# Altium schematic sheet MCU.SchDoc
size A3
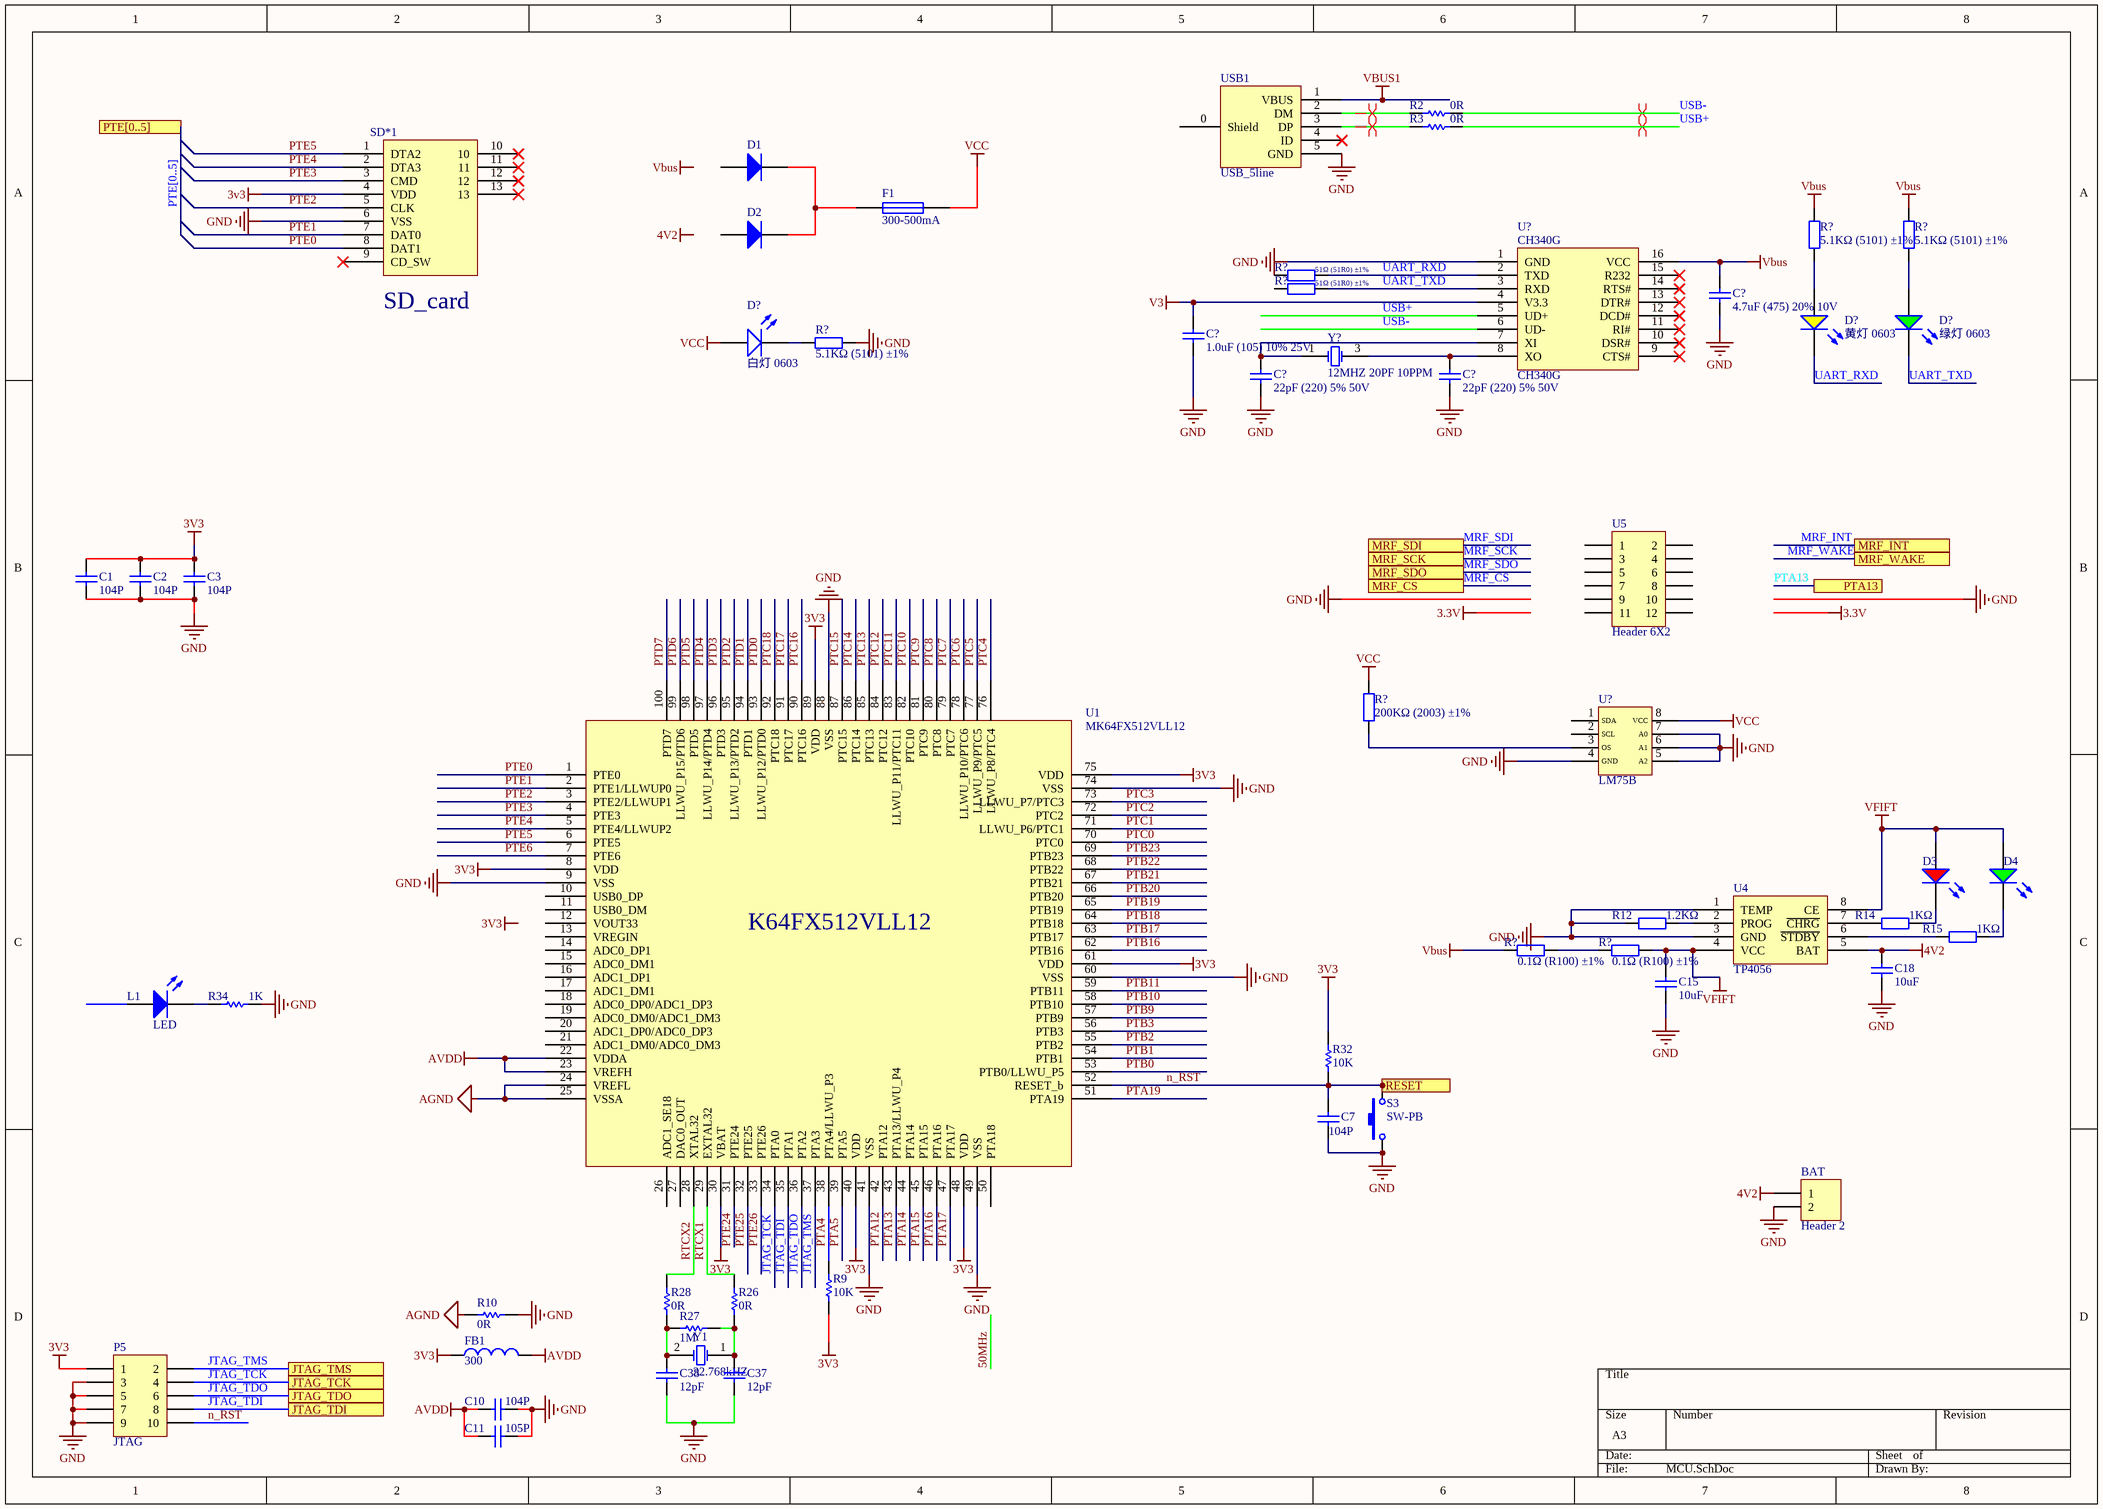
[diagram p0: MCU.SchDoc]

## Parts
(Parts that share a designator on the sheet are numbered #1, #2 ... from top to bottom, then left to right.)
BAT  Header 2  [HDR1X2]
C1  value 104P  [0402]  (hidden comment: Cap)
C2  value 104P  [0402]  (hidden comment: Cap)
C3  value 104P  [0402]  (hidden comment: Cap)
C7  value 104P  [1608[0603]]  (hidden comment: Cap)
C10  value 104P  [0402]  (hidden comment: Cap)
C11  value 105P  [0402]  (hidden comment: Cap)
C15  10uF  [0402_C]
C18  10uF  [0402_C]
C37  value 12pF  [1608[0603]]  (hidden comment: Cap)
C38  value 12pF  [1608[0603]]  (hidden comment: Cap)
C?#1  4.7uF (475) 20% 10V  [0402_C]
C?#2  1.0uF (105) 10% 25V  [0402_C]
C?#3  22pF (220) 5% 50V  [0402_C]
C?#4  22pF (220) 5% 50V  [0402_C]
D1  sk4  [1206(2)]  (value not drawn)
D2  sk4  [1206(2)]  (value not drawn)
D3  红灯 0603  [0603_LED_S1]  (value not drawn)
D4  绿灯 0603  [0603_LED_S1]  (value not drawn)
D?#1  黄灯 0603  [0603_LED_S1]
D?#2  绿灯 0603  [0603_LED_S1]
D?#3  白灯 0603  [0603_LED_S1]
F1  300-500mA  [1206(2)]
FB1  value 300  [0402]  (hidden comment: Inductor)
L1  LED  [1608[0603]]
P5  JTAG  [MHDR2X5]
R2  value 0R  [1608[0603]]  (hidden comment: Res)
R3  value 0R  [1608[0603]]  (hidden comment: Res)
R9  value 10K  [1608[0603]]  (hidden comment: Res)
R10  value 0R  [0402]  (hidden comment: Res)
R12  1.2KΩ  [0402_R]
R14  1KΩ  [0402_R]
R15  1KΩ  [0402_R]
R26  value 0R  [1608[0603]]  (hidden comment: Res)
R27  value 1M  [1608[0603]]  (hidden comment: Res)
R28  value 0R  [1608[0603]]  (hidden comment: Res)
R32  value 10K  [1608[0603]]  (hidden comment: Res)
R34  value 1K  [1608[0603]]  (hidden comment: Res)
R?#1  5.1KΩ (5101) ±1%  [0402_R]
R?#2  5.1KΩ (5101) ±1%  [0402_R]
R?#3  51Ω (51R0) ±1%  [0402_R]
R?#4  51Ω (51R0) ±1%  [0402_R]
R?#5  5.1KΩ (5101) ±1%  [0402_R]
R?#6  200KΩ (2003) ±1%  [0402_R]
R?#7  0.1Ω (R100) ±1%  [1206_R]
R?#8  0.1Ω (R100) ±1%  [1206_R]
S3  SW-PB  [key 3*4*2]
SD*1  TF_card  [TF卡座(短体)]  (value not drawn)
U1  MK64FX512VLL12  [LC-LQFP-100_14x14x05P]
U4  TP4056  [SOP-8_EP_150mil]
U5  Header 6X2  [HDR2X6]
U?#1  CH340G  [SOIC-16_150mil]
U?#2  LM75B  [LC-SOIC-8_150mil]
USB1  USB_5line  [USB-MICRO-5P-2F]
Y1  32.768kHZ  [3215]
Y?  12MHZ 20PF 10PPM  [SMD-3225_4P]

## Ports
JTAG_TCK, JTAG_TDI, JTAG_TDO, JTAG_TMS, MRF_CS, MRF_INT, MRF_SCK, MRF_SDI, MRF_SDO, MRF_WAKE, PTA13, PTE[0..5], RESET

## Nets
3V3: C1.2 C2.2 C3.2 FB1.1 P5.1 R9.1 R32.1 SD*1.4(VDD) U1.8(VDD) U1.30(VBAT) U1.40(VDD) U1.48(VDD) U1.61(VDD) U1.75(VDD) U1.89(VDD)
4V2: BAT.1 C18.2 U4.5(BAT)
AGND: R10.2 U1.24(VREFL) U1.25(VSSA)
AVDD: C10.1 C11.1 FB1.2 U1.22(VDDA) U1.23(VREFH)
GND: BAT.2 C1.1 C2.1 C3.1 C7.1 C10.2 C11.2 C15.1 C18.1 C37.1 C38.1 C?#1.1 C?#2.1 C?#3.1 C?#4.1 P5.3 P5.5 P5.7 P5.9 R10.1 R12.1 R34.1 R?#5.2 S3.1 SD*1.6(VSS) U1.9(VSS) U1.41(VSS) U1.49(VSS) U1.60(VSS) U1.74(VSS) U1.88(VSS) U4.1(TEMP) U4.3(GND) U?#1.1(GND) U?#2.4(GND) U?#2.5(A2) U?#2.6(A1) U?#2.7(A0) USB1.5(GND)
V3: C?#2.2 U?#1.4(V3.3)
Vbus: C?#1.2 R?#1.2 R?#2.2 R?#7.1 U?#1.16(VCC)
VBUS1: USB1.1(VBUS)
VCC: D?#3.A F1.2 R?#6.2 U?#2.8(VCC)
VFIFT: C15.2 D3.A D4.A R?#8.2 U4.4(VCC) U4.8(CE)
JTAG_TCK: P5.4 U1.34(PTA0) ; port JTAG_TCK
JTAG_TDI: P5.8 U1.35(PTA1) ; port JTAG_TDI
JTAG_TDO: P5.6 U1.36(PTA2) ; port JTAG_TDO
JTAG_TMS: P5.2 U1.37(PTA3) ; port JTAG_TMS
MRF_CS: port MRF_CS
MRF_INT: port MRF_INT
MRF_SCK: port MRF_SCK
MRF_SDI: port MRF_SDI
MRF_SDO: port MRF_SDO
MRF_WAKE: port MRF_WAKE
n_RST: C7.2 P5.10 R32.2 S3.2 U1.52(RESET_b) ; port RESET
PTA4: R9.2 U1.38(PTA4/LLWU_P3)
PTA5: U1.39(PTA5)
PTA12: U1.42(PTA12)
PTA13: U1.43(PTA13/LLWU_P4) ; port PTA13
PTA14: U1.44(PTA14)
PTA15: U1.45(PTA15)
PTA16: U1.46(PTA16)
PTA17: U1.47(PTA17)
PTA19: U1.51(PTA19)
PTB0: U1.53(PTB0/LLWU_P5)
PTB1: U1.54(PTB1)
PTB2: U1.55(PTB2)
PTB3: U1.56(PTB3)
PTB9: U1.57(PTB9)
PTB10: U1.58(PTB10)
PTB11: U1.59(PTB11)
PTB16: U1.62(PTB16)
PTB17: U1.63(PTB17)
PTB18: U1.64(PTB18)
PTB19: U1.65(PTB19)
PTB20: U1.66(PTB20)
PTB21: U1.67(PTB21)
PTB22: U1.68(PTB22)
PTB23: U1.69(PTB23)
PTC0: U1.70(PTC0)
PTC1: U1.71(LLWU_P6/PTC1)
PTC2: U1.72(PTC2)
PTC3: U1.73(LLWU_P7/PTC3)
PTC4: U1.76(LLWU_P8/PTC4)
PTC5: U1.77(LLWU_P9/PTC5)
PTC6: U1.78(LLWU_P10/PTC6)
PTC7: U1.79(PTC7)
PTC8: U1.80(PTC8)
PTC9: U1.81(PTC9)
PTC10: U1.82(PTC10)
PTC11: U1.83(LLWU_P11/PTC11)
PTC12: U1.84(PTC12)
PTC13: U1.85(PTC13)
PTC14: U1.86(PTC14)
PTC15: U1.87(PTC15)
PTC16: U1.90(PTC16)
PTC17: U1.91(PTC17)
PTC18: U1.92(PTC18)
PTD0: U1.93(LLWU_P12/PTD0)
PTD1: U1.94(PTD1)
PTD2: U1.95(LLWU_P13/PTD2)
PTD3: U1.96(PTD3)
PTD4: U1.97(LLWU_P14/PTD4)
PTD5: U1.98(PTD5)
PTD6: U1.99(LLWU_P15/PTD6)
PTD7: U1.100(PTD7)
PTE0: SD*1.8(DAT1) U1.1(PTE0)
PTE1: SD*1.7(DAT0) U1.2(PTE1/LLWUP0)
PTE2: SD*1.5(CLK) U1.3(PTE2/LLWUP1)
PTE3: SD*1.3(CMD) U1.4(PTE3)
PTE4: SD*1.2(DTA3) U1.5(PTE4/LLWUP2)
PTE5: SD*1.1(DTA2) U1.6(PTE5)
PTE6: U1.7(PTE6)
PTE24: U1.31(PTE24)
PTE25: U1.32(PTE25)
PTE26: U1.33(PTE26)
RTCX1: R26.2 U1.29(EXTAL32)
RTCX2: R28.2 U1.28(XTAL32)
UART_RXD: D?#1.K R?#3.2 U?#1.2(TXD)
UART_TXD: D?#2.K R?#4.2 U?#1.3(RXD)
USB+: R3.1 U?#1.5(UD+)
USB-: R2.1 U?#1.6(UD-)
NetC37_2: C37.2 R26.1 R27.1 Y1.1(OSC1)
NetC38_2: C38.2 R27.2 R28.1 Y1.2(OSC2)
NetC?#3_2: C?#3.2 U?#1.7(XI) Y?.1(OSC1)
NetC?#4_2: C?#4.2 U?#1.8(XO) Y?.3(OSC2)
NetD1_2: D1.2(K) D2.2(K) F1.1
NetD3_K: D3.K R14.2
NetD4_K: D4.K R15.2
NetD?#1_A: D?#1.A R?#1.1
NetD?#2_A: D?#2.A R?#2.1
NetD?#3_K: D?#3.K R?#5.1
NetL1_2: L1.2(K) R34.2
NetR2_2: R2.2 USB1.2(DM)
NetR3_2: R3.2 USB1.3(DP)
NetR12_2: R12.2 U4.2(PROG)
NetR14_1: R14.1 U4.7(~{CHRG})
NetR15_1: R15.1 U4.6(~{STDBY})
NetR?#6_1: R?#6.1 U?#2.3(OS)
NetR?#7_2: R?#7.2 R?#8.1

Not connected (* = marked no-connect by the designer): D1 1(A); D2 1(A); L1 1(A); R?#3 1; R?#4 1; SD*1 9(CD_SW)* 10* 11* 12* 13*; U1 10(USB0_DP) 11(USB0_DM) 12(VOUT33) 13(VREGIN) 14(ADC0_DP1) 15(ADC0_DM1) 16(ADC1_DP1) 17(ADC1_DM1) 18(ADC0_DP0/ADC1_DP3) 19(ADC0_DM0/ADC1_DM3) 20(ADC1_DP0/ADC0_DP3) 21(ADC1_DM0/ADC0_DM3) 26(ADC1_SE18) 27(DAC0_OUT) 50(PTA18); U5 1 2 3 4 5 6 7 8 9 10 11 12; U?#1 9(CTS#)* 10(DSR#)* 11(RI#)* 12(DCD#)* 13(DTR#)* 14(RTS#)* 15(R232)*; U?#2 1(SDA) 2(SCL); USB1 0(Shield) 4(ID)*

## Buses and harness runs
bus PTE[0..5] = port PTE[0..5]

## Layout directives
differential pair: NetR2_2, NetR3_2, USB+, USB-

## Notes on the sheet
- Labels drawn without touching a wire or pin: 3V3, 4V2, Vbus
- (in symbol MK64FX512VLL12) K64FX512VLL12
- (in symbol TF_card) SD_card

## Library data of the parts
BAT = Header 2: Header, 2-Pin; LatestRevisionDate: 17-Jul-2002; LatestRevisionNote: Re-released for DXP Platform.; Publisher: Altium Limited
C1-C3 C7 C10 C11 C37 C38 = Cap: 贴片电容; Published: 8-Jun-2000; LatestRevisionDate: 17-Jul-2002; LatestRevisionNote: Re-released for DXP Platform.; PackageReference: RAD-0.3; Publisher: Altium Limited
C15 C18 = 0402 10uF (106) 20% 6.3V: 贴片电容; ComponentLink1Description: 供应商链接; ComponentLink1URL: http://www.szlcsc.com/product/details_16204.html; Package: 0402; Supplier: LC; SuppliersPartNumber: C15525
C?#1 = 0402 4.7uF (475) 20% 10V: 贴片电容; ComponentLink1Description: 供应商链接; ComponentLink1URL: http://www.szlcsc.com/product/details_24469.html; Package: 0402; Supplier: LC; SuppliersPartNumber: C23733
C?#2 = 0402 1.0uF (105) 10% 25V: 贴片电容; ComponentLink1Description: 供应商链接; ComponentLink1URL: http://www.szlcsc.com/product/details_53938.html; Package: 0402; Supplier: LC; SuppliersPartNumber: C52923
C?#3 C?#4 = 0402 22pF (220) 5% 50V: 贴片电容; ComponentLink1Description: 供应商链接; ComponentLink1URL: http://www.szlcsc.com/product/details_1907.html; Package: 0402; Supplier: LC; SuppliersPartNumber: C1555
D1 D2 = Diode 1N4001: 1 Amp General Purpose Rectifier; Published: 8-Jun-2000; LatestRevisionDate: 17-Jul-2002; LatestRevisionNote: Re-released for DXP Platform.; DatasheetVersion: 1998; PackageVersion: Aug-1999; PackageReference: DO-41; Publisher: Altium Limited; PackageDescription: Diode, Axial; Body 5.2 x 2.7 mm (LxDia. max), Lead Dia. 0.86 mm (max); Code_JEDEC: DO-204-AL; ComponentLink1Description: Manufacturer Link; ComponentLink1URL: http://www.fairchildsemi.com/; ComponentLink2Description: Datasheet; ComponentLink2URL: http://www.fairchildsemi.com/ds/1N%2F1N4001.pdf
D3 = 0603 红灯: 发光二极管; ComponentLink1Description: 供应商链接; ComponentLink1URL: http://www.szlcsc.com/product/details_2659.html; Package: 0603; Supplier: LC; SuppliersPartNumber: C2286
D4 D?#2 = 0603 绿灯: 发光二极管; ComponentLink1Description: 供应商链接; ComponentLink1URL: http://www.szlcsc.com/product/details_73152.html; Package: 0603; Supplier: LC; SuppliersPartNumber: C72043
D?#1 = 0603 黄灯: 发光二极管; ComponentLink1Description: 供应商链接; ComponentLink1URL: http://www.szlcsc.com/product/details_73147.html; Package: 0603; Supplier: LC; SuppliersPartNumber: C72038
D?#3 = 0603 白灯: 发光二极管; ComponentLink1Description: 供应商链接; ComponentLink1URL: http://www.szlcsc.com/product/details_2663.html; Package: 0603; Supplier: LC; SuppliersPartNumber: C2290
F1 = Fuse 1: Fuse; Published: 8-Jun-2000; LatestRevisionDate: 17-Jul-2002; LatestRevisionNote: Re-released for DXP Platform.; PackageReference: PIN-W2/E2.8; Publisher: Altium Limited
FB1 = Inductor: Code_IEC: 1005; Published: 8-Jun-2000; LatestRevisionDate: 29-May-2009; LatestRevisionNote: IPC-7351 Footprint Added.; PackageReference: 0402-A; Publisher: Altium Limited; PackageDescription: Chip Inductor; Code_JEITA: 0402
P5 = Header 5X2: Header, 5-Pin, Dual row; LatestRevisionDate: 17-Jul-2002; LatestRevisionNote: Re-released for DXP Platform.; Publisher: Altium Limited
R2 R3 R9 R10 R26-R28 R32 R34 = Res: 贴片电阻; Published: 8-Jun-2000; LatestRevisionDate: 17-Jul-2002; LatestRevisionNote: Re-released for DXP Platform.; PackageReference: AXIAL-0.3; Publisher: Altium Limited
R12 = 0402 1.2KΩ (1201) 1%: 贴片电阻; ComponentLink1Description: 供应商链接; ComponentLink1URL: http://www.szlcsc.com/product/details_26605.html; Package: 0402; Supplier: LC; SuppliersPartNumber: C25862
R14 R15 = 0402 1KΩ (1001) 1%: 贴片电阻; ComponentLink1Description: 供应商链接; ComponentLink1URL: http://www.szlcsc.com/product/details_12256.html; Package: 0402; Supplier: LC; SuppliersPartNumber: C11702
R?#1 R?#2 R?#5 = 0402 5.1KΩ (5101) 1%: 贴片电阻; ComponentLink1Description: 供应商链接; ComponentLink1URL: http://www.szlcsc.com/product/details_26648.html; Package: 0402; Supplier: LC; SuppliersPartNumber: C25905
R?#3 R?#4 = 0402 51Ω (51R0) 1%: 贴片电阻; ComponentLink1Description: 供应商链接; ComponentLink1URL: http://www.szlcsc.com/product/details_25868.html; Package: 0402; Supplier: LC; SuppliersPartNumber: C25125
R?#6 = 0402 200KΩ (2003) 1%: 贴片电阻; ComponentLink1Description: 供应商链接; ComponentLink1URL: http://www.szlcsc.com/product/details_26507.html; Package: 0402; Supplier: LC; SuppliersPartNumber: C25764
R?#7 R?#8 = 1206 0.1Ω (R100) 1%: 贴片电阻; ComponentLink1Description: 供应商链接; ComponentLink1URL: http://www.szlcsc.com/product/details_26077.html; Package: 1206; Supplier: LC; SuppliersPartNumber: C25334
S3 = SW-PB: Switch
SD*1 = TF_card: pin to pad: 9>0 10>0 11>0 12>0 13>0
U4 = TP4056_[C16581]: 电池电源管理; ComponentLink1Description: 供应商链接; ComponentLink1URL: http://www.szlcsc.com/product/details_17264.html; Package: SOP-8_EP_150mil; Supplier: LC; SuppliersPartNumber: C16581
U5 = Header 6X2: Header, 6-Pin, Dual row; LatestRevisionDate: 17-Jul-2002; LatestRevisionNote: Re-released for DXP Platform.; Publisher: Altium Limited
U?#1 = CH340G_[C14267]: USB; ComponentLink1Description: 供应商链接; ComponentLink1URL: http://www.szlcsc.com/product/details_14927.html; Package: SOIC-16_150mil; Supplier: LC; SuppliersPartNumber: C14267
Y1 = XTAL: 晶体振荡器; Published: 8-Jun-2000; LatestRevisionDate: 17-Jul-2002; LatestRevisionNote: Re-released for DXP Platform.; PackageReference: R38; Publisher: Altium Limited
Y? = SMD-3225_4P  12MHZ 20PF 10PPM: 贴片晶振; ComponentLink1Description: 供应商链接; ComponentLink1URL: http://www.szlcsc.com/product/details_9522.html; Package: SMD-3225_4P; Supplier: LC; SuppliersPartNumber: C9002